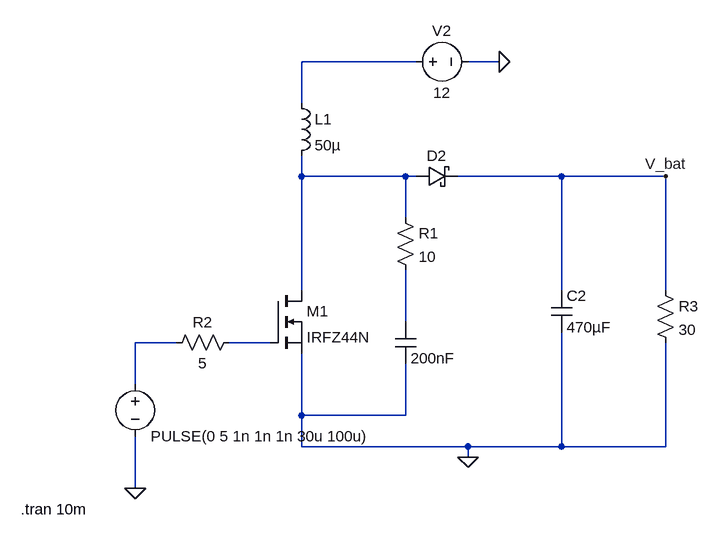
[diagram p0: schematic boost.asc]
boost.asc, the LTspice schematic file:
Version 4
SHEET 1 4320 680
WIRE 1088 -304 912 -304
WIRE 1216 -304 1168 -304
WIRE 912 -240 912 -304
WIRE 912 -128 912 -160
WIRE 1072 -128 912 -128
WIRE 1088 -128 1072 -128
WIRE 1312 -128 1152 -128
WIRE 1472 -128 1312 -128
WIRE 1072 -64 1072 -128
WIRE 912 48 912 -128
WIRE 1312 48 1312 -128
WIRE 1472 48 1472 -128
WIRE 1072 96 1072 16
WIRE 720 128 656 128
WIRE 864 128 800 128
WIRE 656 192 656 128
WIRE 912 240 912 144
WIRE 1072 240 1072 160
WIRE 1072 240 912 240
WIRE 912 288 912 240
WIRE 1168 288 912 288
WIRE 1312 288 1312 112
WIRE 1312 288 1168 288
WIRE 1472 288 1472 128
WIRE 1472 288 1312 288
WIRE 1168 304 1168 288
WIRE 656 352 656 272
FLAG 1216 -304 0
FLAG 1168 304 0
FLAG 1472 -128 V_bat
FLAG 656 352 0
SYMBOL ind 896 -256 R0
SYMATTR InstName L1
SYMATTR Value 50µ
SYMBOL voltage 1072 -304 R270
WINDOW 0 32 56 VTop 2
WINDOW 3 -32 56 VBottom 2
WINDOW 123 0 0 Left 0
WINDOW 39 0 0 Left 0
SYMATTR InstName V2
SYMATTR Value 12
SYMBOL voltage 656 176 R0
WINDOW 0 24 16 Invisible 2
WINDOW 123 0 0 Left 0
WINDOW 39 0 0 Left 0
SYMATTR InstName V4
SYMATTR Value PULSE(0 5 1n 1n 1n 30u 100u)
SYMBOL cap 1296 48 R0
SYMATTR InstName C2
SYMATTR Value 470µF
SYMBOL schottky 1088 -112 R270
WINDOW 0 32 32 VTop 2
WINDOW 3 0 32 Invisible 2
SYMATTR InstName D2
SYMATTR Value RBR5LAM60A
SYMATTR Description Diode
SYMATTR Type diode
SYMBOL nmos 864 48 R0
SYMATTR InstName M1
SYMATTR Value IRFZ44N
SYMBOL res 816 112 R90
WINDOW 0 0 56 VBottom 2
WINDOW 3 32 56 VTop 2
SYMATTR InstName R2
SYMATTR Value 5
SYMBOL res 1456 32 R0
SYMATTR InstName R3
SYMATTR Value 30
SYMBOL cap 1056 96 R0
WINDOW 0 24 8 Invisible 2
SYMATTR InstName C1
SYMATTR Value 200nF
SYMBOL res 1056 -80 R0
SYMATTR InstName R1
SYMATTR Value 10
TEXT 480 384 Left 2 !.tran 10m

The netlist it stands for:
* boost.asc
L1 N001 N002 50µ
V2 N001 0 12
V4 N004 0 PULSE(0 5 1n 1n 1n 30u 100u)
C2 V_bat 0 470µF
D2 N002 V_bat RBR5LAM60A
M1 N002 N005 0 0 IRFZ44N
R2 N005 N004 5
R3 V_bat 0 30
C1 N003 0 200nF
R1 N002 N003 10
.model D D
.lib standard.dio
.model NMOS NMOS
.model PMOS PMOS
.lib standard.mos
.tran 10m
.backanno
.end